# Altium schematic sheet GH3020_PD_Board.SchDoc
size A4; SheetNumber: 1; SheetTotal: 1
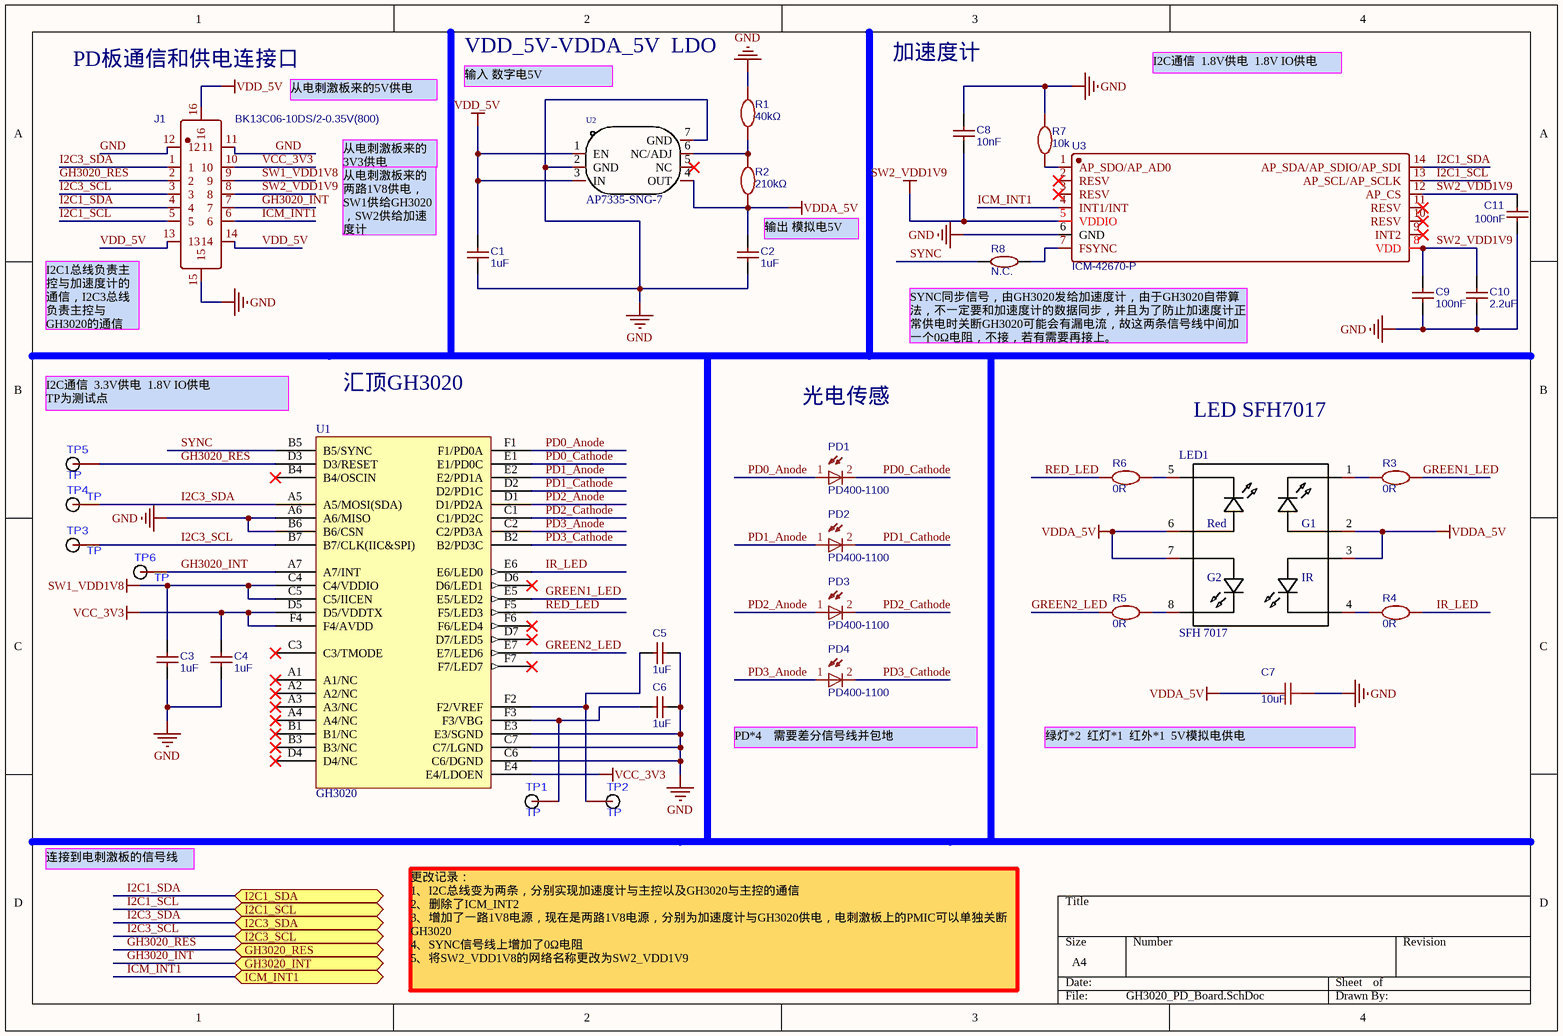
[diagram p0: GH3020_PD_Board.SchDoc]

## Parts
C1  1uF  [C0201]
C2  1uF  [C0201]
C3  1uF  [C0201]
C4  1uF  [C0201]
C5  1uF  [C0201]
C6  1uF  [C0201]
C7  10uF  [C0603]
C8  10nF  [C0201]
C9  100nF  [C0201]
C10  2.2uF  [C0201]
C11  100nF  [C0201]
J1  BK13C06-10DS/2-0.35V(800)  [CONN-SMD_BK13C06-10DS-2-0.35V-800]
LED1  SFH 7017  [SFH7017]
PD1  PD400-1100  [SFH2703]
PD2  PD400-1100  [SFH2703]
PD3  PD400-1100  [SFH2703]
PD4  PD400-1100  [SFH2703]
R1  40kΩ  [0603R]
R2  210kΩ  [0603R]
R3  0R  [RES0201]
R4  0R  [RES0201]
R5  0R  [RES0201]
R6  0R  [RES0201]
R7  10k  [RES0201]
R8  N.C.  [C0201]
TP1  TP  [Testpoint]
TP2  TP  [Testpoint]
TP3  TP  [Testpoint]
TP4  TP  [Testpoint]
TP5  TP  [Testpoint]
TP6  TP  [Testpoint]
U1  GH3020  [WLCSP42]
U2  AP7335-SNG-7  [U-DFN2020-6_L2.0-W2.0-P0.65-BL-EP]
U3  ICM-42670-P  [LGA-14_L3.0-W2.5-P0.50-TL_QMI8658A]

## Ports
GH3020_INT (bidir), GH3020_RES (bidir), I2C1_SCL (bidir), I2C1_SDA (bidir), I2C3_SCL (bidir), I2C3_SDA (bidir), ICM_INT1 (bidir)

## Nets
GND: C1.2 C2.2 C3.2 C4.2 C5.2 C6.2 C7.1 C8.2 C9.1 C10.2 C11.2 J1.11 J1.12 J1.15 R1.2 R7.1 U1.A6(A6/MISO) U1.B6(B6/CSN) U1.C6(C6/DGND) U1.C7(C7/LGND) U1.E3(E3/SGND) U2.2(GND) U2.7(GND) U3.6(GND)
SW1_VDD1V8: C3.1 J1.9 U1.C4(C4/VDDIO) U1.C5(C5/IICEN)
SW2_VDD1V9: C8.1 C9.2 C10.1 C11.1 J1.8 U3.5(VDDIO) U3.8(VDD) U3.12(AP_CS)
VCC_3V3: C4.1 J1.10 U1.D5(D5/VDDTX) U1.E4(E4/LDOEN) U1.F4(F4/AVDD)
VDD_5V: C1.1 J1.13 J1.14 J1.16 U2.1(EN) U2.3(IN)
VDDA_5V: C2.1 C7.2 LED1.2(K_red) LED1.3(Anode) LED1.6(K_red) LED1.7(K_red) R2.1 U2.4(OUT)
GH3020_INT: J1.7 TP6.1(text) U1.A7(A7/INT) ; port GH3020_INT
GH3020_RES: J1.2 TP5.1(text) U1.D3(D3/RESET) ; port GH3020_RES
GREEN1_LED: R3.1 U1.E5(E5/LED2)
GREEN2_LED: R5.2 U1.E7(E7/LED6)
I2C1_SCL: J1.5 U3.13(AP_SCL/AP_SCLK) ; port I2C1_SCL
I2C1_SDA: J1.4 U3.14(AP_SDA/AP_SDIO/AP_SDI) ; port I2C1_SDA
I2C3_SCL: J1.3 TP3.1(text) U1.B7(B7/CLK(IIC&SPI)) ; port I2C3_SCL
I2C3_SDA: J1.1 TP4.1(text) U1.A5(A5/MOSI(SDA)) ; port I2C3_SDA
ICM_INT1: J1.6 U3.4(INT1/INT) ; port ICM_INT1
IR_LED: R4.1 U1.E6(E6/LED0)
PD0_Anode: PD1.1 U1.F1(F1/PD0A)
PD0_Cathode: PD1.2 U1.E1(E1/PD0C)
PD1_Anode: PD2.1 U1.E2(E2/PD1A)
PD1_Cathode: PD2.2 U1.D2(D2/PD1C)
PD2_Anode: PD3.1 U1.D1(D1/PD2A)
PD2_Cathode: PD3.2 U1.C1(C1/PD2C)
PD3_Anode: PD4.1 U1.C2(C2/PD3A)
PD3_Cathode: PD4.2 U1.B2(B2/PD3C)
RED_LED: R6.2 U1.F5(F5/LED3)
SYNC: R8.2 U1.B5(B5/SYNC)
NetC5_1: C5.1 TP2.1(text) U1.F2(F2/VREF)
NetC6_1: C6.1 TP1.1(text) U1.F3(F3/VBG)
NetLED1_1: LED1.1(K_red) R3.2
NetLED1_4: LED1.4(K_red) R4.2
NetLED1_5: LED1.5(K_red) R6.1
NetLED1_8: LED1.8(K_IR) R5.1
NetR1_1: R1.1 R2.2 U2.6(NC/ADJ)
NetR7_2: R7.2 U3.1(AP_SDO/AP_AD0)
NetR8_1: R8.1 U3.7(FSYNC)

Not connected (* = marked no-connect by the designer): U1 A1(A1/NC)* A2(A2/NC)* A3(A3/NC)* A4(A4/NC)* B1(B1/NC)* B3(B3/NC)* B4(B4/OSCIN)* C3(C3/TMODE)* D4(D4/NC)* D6(D6/LED1)* D7(D7/LED5)* F6(F6/LED4)* F7(F7/LED7)*; U2 5(NC)*; U3 2(RESV)* 3(RESV)* 9(INT2)* 10(RESV)* 11(RESV)*

## Notes on the sheet
- (near J1) PD板通信和供电连接口
- 从电刺激板来的5V供电
- VDD_5V-VDDA_5V  LDO
- 输入 数字电5V
- 加速度计
- I2C通信  1.8V供电  1.8V IO供电
- 从电刺激板来的3V3供电
- (near C1) 从电刺激板来的两路1V8供电，SW1供给GH3020，SW2供给加速度计
- 输出 模拟电5V
- (near J1) I2C1总线负责主控与加速度计的通信，I2C3总线负责主控与GH3020的通信
- SYNC同步信号，由GH3020发给加速度计，由于GH3020自带算法，不一定要和加速度计的数据同步，并且为了防止加速度计正常供电时关断GH3020可能会有漏电流，故这两条信号线中间加一个0Ω电阻，不接，若有需要再接上。
- I2C通信  3.3V供电  1.8V IO供电
  TP为测试点
- 汇顶GH3020
- 光电传感
- LED SFH7017
- PD*4    需要差分信号线并包地
- (near C7) 绿灯*2  红灯*1  红外*1  5V模拟电供电
- 连接到电刺激板的信号线
- 更改记录：
  1、I2C总线变为两条，分别实现加速度计与主控以及GH3020与主控的通信
  2、删除了ICM_INT2
  3、增加了一路1V8电源，现在是两路1V8电源，分别为加速度计与GH3020供电，电刺激板上的PMIC可以单独关断GH3020
  4、SYNC信号线上增加了0Ω电阻
  5、将SW2_VDD1V8的网络名称更改为SW2_VDD1V9
- (in symbol SFH 7017) Red; G1; G2; IR

## Library data of the parts
C1-C6 = 1uF: GRM033R61A105ME44D / 精度: ±20% / 额定电压: 10V / 材质(温度系数): X5R; BOM_Manufacturer Part: CL10A105KB8NNNC; BOM_Manufacturer: SAMSUNG(三星); nameAlias: Capacitance; BOM_Supplier: LCSC; BOM_Supplier Part: C15849; BOM_JLCPCB Part Class: Basic Part; spicePre: C; spiceSymbolName: CL10A105KB8NNNC
C7 = C0603: HGC0603R5106M250NTHJ / 品牌: Chinocera(华瓷) / 封装: 0603 / 容值: 10uF / 精度: ±20% / 额定电压: 25V / 材质(温度系数): X5R; BOM_Manufacturer: SAMSUNG(三星); BOM_Manufacturer Part: CL10A225KB8NNNC; Contributor: LCSC; nameAlias: Capacitance; BOM_Supplier: LCSC; BOM_Supplier Part: C913904; BOM_JLCPCB Part Class: Extended Part; spicePre: C; spiceSymbolName: CL10A225KB8NNNC
C8 = 1uF: 0201B103K250NT / 精度: ±10% / 额定电压: 25V / 材质(温度系数): X7R; BOM_Manufacturer Part: CL10A105KB8NNNC; BOM_Manufacturer: SAMSUNG(三星); nameAlias: Capacitance; BOM_Supplier: LCSC; BOM_Supplier Part: C15849; BOM_JLCPCB Part Class: Basic Part; spicePre: C; spiceSymbolName: CL10A105KB8NNNC
C9 C11 = 1uF: CL03A104KO3NNNC / 精度: ±10% / 额定电压: 16V / 材质(温度系数): X5R; BOM_Manufacturer Part: CL10A105KB8NNNC; BOM_Manufacturer: SAMSUNG(三星); nameAlias: Capacitance; BOM_Supplier: LCSC; BOM_Supplier Part: C15849; BOM_JLCPCB Part Class: Basic Part; spicePre: C; spiceSymbolName: CL10A105KB8NNNC
C10 = 1uF: GRM033R61A225KE47D / 精度: ±10% / 额定电压: 10V / 材质(温度系数): X5R; BOM_Manufacturer Part: CL10A105KB8NNNC; BOM_Manufacturer: SAMSUNG(三星); nameAlias: Capacitance; BOM_Supplier: LCSC; BOM_Supplier Part: C15849; BOM_JLCPCB Part Class: Basic Part; spicePre: C; spiceSymbolName: CL10A105KB8NNNC
J1 = 10pin_ds_BK13C06-10DS/2-0.35V(800): Manufacturer: HRS(广濑); Contributor: lcsc; Supplier: LCSC; Supplier Part: C3024358; Manufacturer Part: BK13C06-10DS/2-0.35V(800); JLCPCB Part Class: Extended Part; spicePre: C; spiceSymbolName: BK13C06-10DS/2-0.35V(800)
PD1-PD4 = SFH2073: Contributor: Joshua312; spicePre: L; spiceSymbolName: vemd5010x01
R1 = 200kΩ: SCR0603F40K / 精度: ±1% / 功率: 100mW; BOM_Manufacturer: PANASONIC(松下); BOM_Manufacturer Part: ERJPB6B2003V; Resistance (Ohms): 200K; nameAlias: Resistance; Contributor: LCSC; BOM_Supplier: LCSC; BOM_Supplier Part: C413709; BOM_JLCPCB Part Class: Extended Part; spicePre: R; spiceSymbolName: ERJPB6B2003V
R2 = 200kΩ: 0603WAF2103T5E / 精度: ±1% / 功率: 100mW; BOM_Manufacturer: PANASONIC(松下); BOM_Manufacturer Part: ERJPB6B2003V; Resistance (Ohms): 200K; nameAlias: Resistance; Contributor: LCSC; BOM_Supplier: LCSC; BOM_Supplier Part: C413709; BOM_JLCPCB Part Class: Extended Part; spicePre: R; spiceSymbolName: ERJPB6B2003V
R3-R6 = RES0201: 0201WMF0000TEE / 精度: ±1% / 功率: 50mW; BOM_Manufacturer: UNI-ROYAL(厚声); BOM_Manufacturer Part: TC0325B1000T5F; Resistance: 100Ω; Contributor: lcsc; BOM_Supplier: LCSC; BOM_Supplier Part: C2989113; link: https://atta.szlcsc.com/upload/public/pdf/source/20220708/6ACD1707201702E70C0F417A19EB926E.pdf; spicePre: U; spiceSymbolName: TC0325B1000T5F
R7 = RES0201: 0201WMF1002TEE / 精度: ±1% / 功率: 50mW; BOM_Manufacturer: UNI-ROYAL(厚声); BOM_Manufacturer Part: TC0325B1000T5F; Resistance: 100Ω; Contributor: lcsc; BOM_Supplier: LCSC; BOM_Supplier Part: C2989113; link: https://atta.szlcsc.com/upload/public/pdf/source/20220708/6ACD1707201702E70C0F417A19EB926E.pdf; spicePre: U; spiceSymbolName: TC0325B1000T5F
R8 = 0Ω: 0201WMF0000TEE / 精度: ±1% / 功率: 50mW; BOM_Manufacturer: PANASONIC(松下); BOM_Manufacturer Part: ERJ3GEY0R00V; nameAlias: Resistance; Resistance (Ohms): 0; BOM_Supplier: LCSC; BOM_Supplier Part: C122704; BOM_JLCPCB Part Class: Extended Part; spicePre: R; spiceSymbolName: ERJ-3GEY0R00V
U2 = AP7335-18SNG-7: AP7335-SNG-7 / 品牌: DIODES(美台) / 封装: DFN2020-6 / 输出类型: 可调 / 最大输入电压: 6V / 输出电压: 800mV~5V / 输出电流: 300mA; Add into BOM: yes; Output Type: 固定; Output Voltage: 1.8V; Power Supply Rejection Ratio (PSRR): 65dB@(1kHz); Dropout Voltage: 300mV@(300mA); Output Polarity: 正极; Number of Outputs: 1; Symbol: AP7335-18SNG-7; Device: AP7335-18SNG-7; Supplier: LCSC; Supplier Part: C460378; Manufacturer: DIODES(美台); Manufacturer Part: AP7335-18SNG-7; JLCPCB Part Class: 扩展库; LCSC Part Name: 输入6V 输出1.8V 300mA; Supplier Footprint: DFN2020-6-EP; Datasheet: https://atta.szlcsc.com/upload/public/pdf/source/20200309/C493500_EBC19BD8A6CBB65220400EB633A585F0.pdf; Convert to PCB: yes; Maximum Input Voltage: 6V; MAX Output Current: 300mA; Name: AP7335-SNG-7
U3 = ICM-42670-P: Manufacturer: TDK InvenSense(应美盛); Contributor: lcsc; Supplier: LCSC; Supplier Part: C3288646; Manufacturer Part: ICM-42670-P; JLCPCB Part Class: Extended Part; spicePre: U; spiceSymbolName: ICM-42670-P